# EasyEDA Pro project Development Board F.epro, board PCB1
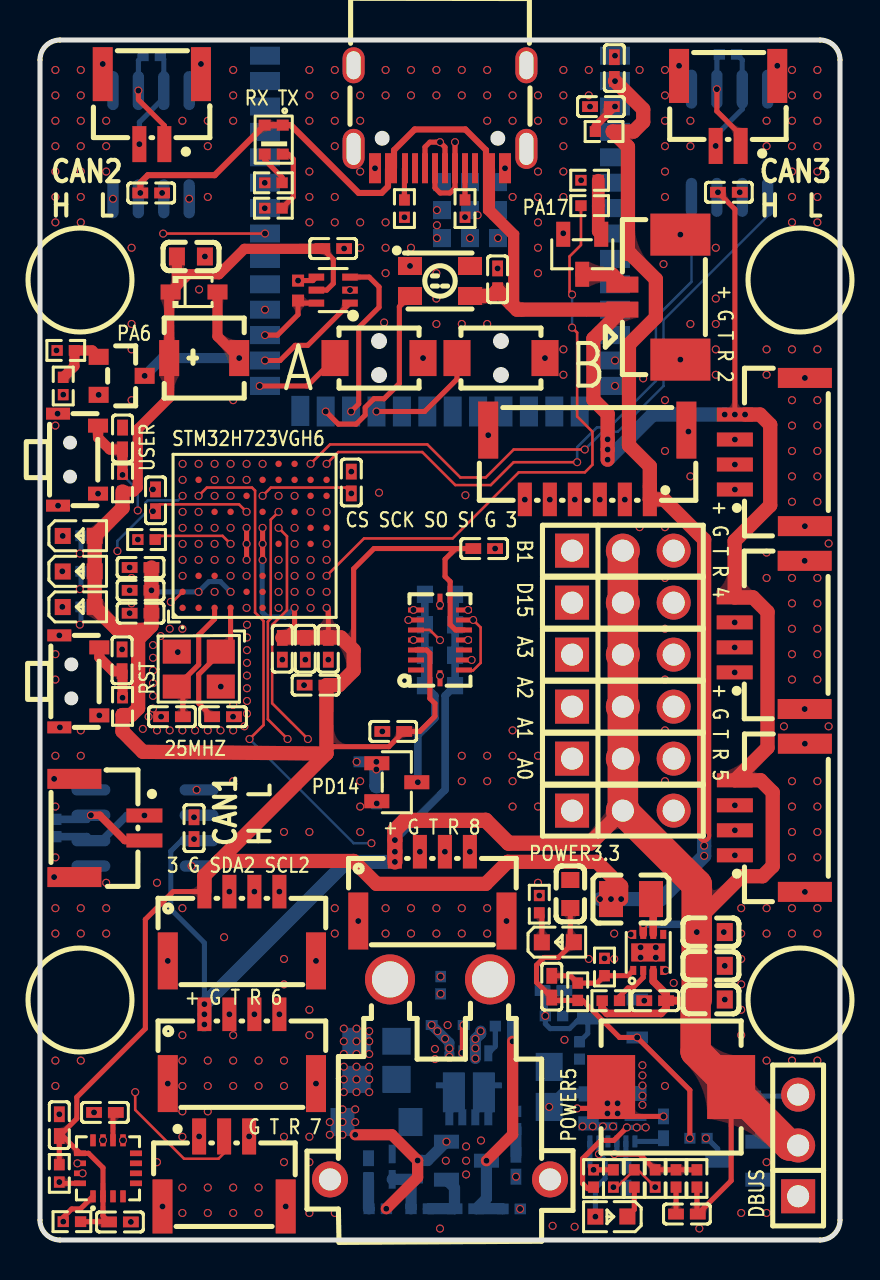
[diagram p1: board, top side]
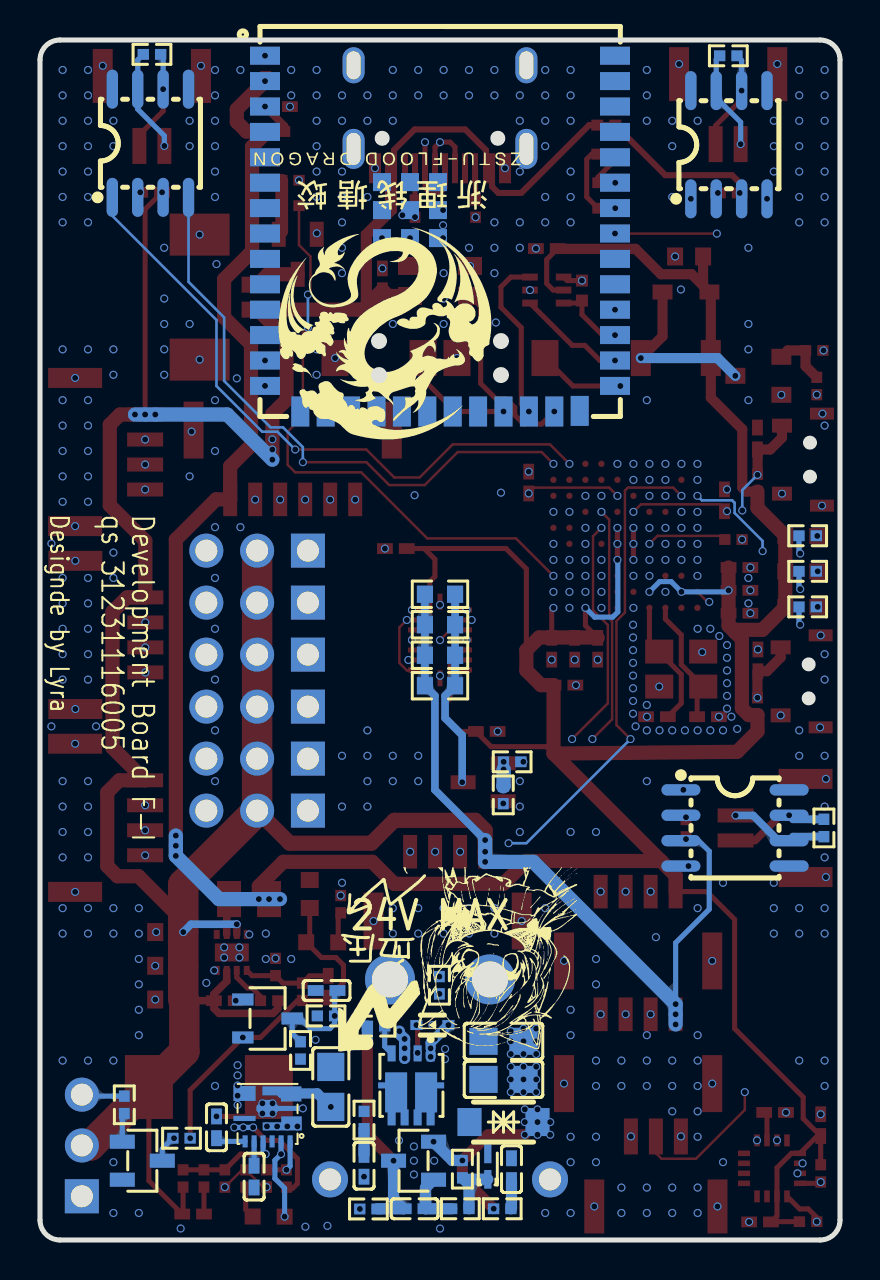
[diagram p2: board, bottom side, seen from below]

Outline 40 x 60 mm; copper layers: Top Layer, Inner1, Inner2, Inner3, Inner4, Bottom Layer. Coordinates in mm from the lower left corner of the outline.
Outline path: 0,59 0,1 arc(0.29,0.29) 1,0 39,0 arc(39.71,0.29) 40,1 40,59 arc(39.71,59.71) 39,60 1,60 arc(0.29,59.71) 0,59
Stack: Top Layer 0.035mm 外层铜厚1oz / Dielectric1 0.0994mm 3313 RC57% 4.2mil / Inner1 0.0152mm 内层铜厚 / Dielectric2 0.55mm 0.55mm H/H不含铜 / Inner2 0.0152mm 内层铜厚 / Dielectric3 0.1088mm 2116 RC54% 4.9mil / Inner3 0.0152mm 内层铜厚 / Dielectric4 0.55mm 0.55mm H/H不含铜 / Inner4 0.0152mm 内层铜厚 / Dielectric5 0.0994mm 3313 RC57% 4.2mil / Bottom Layer 0.035mm 外层铜厚1oz

## Design rules (mm)
net ESP_DP: DP1
net ESP_DN: DP1
template: 自定义配置
spacing copperThickness1oz: track to track 0.102, other pairs 0.152 to 0.3
spacing copperThickness2oz: track to track 0.203, other pairs 0.152 to 0.3
spacing copperThicknessInner0.5oz (default): track to track 0.089, other pairs 0.089 to 0.3
track width copperThickness1oz: min 0.102, default 0.254, max 2.54
track width copperThickness2oz: min 0.203, default 0.254, max 2.54
track width copperThickness0.5oz (default): min 0.089, default 0.254, max 2.54
differential pair differentialPair (default): width min 0.127, default 0.254, max 2.54; gap min 0.152, default 0.152
via viaSize (default): diameter min 0.3, default 0.4, max 10; hole min 0.2, default 0.3, max 6.3
net +24V uses copperRegion1
net +5V uses copperRegion1
net $1N3813 uses copperRegion1
net +3.3V uses copperRegion1
net ADC_BAT uses copperRegion1
net +24V_BAT uses copperRegion1
net GND_BAT uses copperRegion1

## Placement (name value [footprint] x y rotation side)
BUZZER3  4000Hz  [BUZ-SMD_L4.0-W4.0-P3.50-L]  8.21 44.1 0 top
C7  100nF  [C0402]  31.18 5.63 270 bottom
C8  220pF  [C0402]  32.34 1.3 0 top
C12  2.2uF  [C0402]  29.3 3.17 90 bottom
C13  10uF  [C0402]  30.76 11.97 0 top
C14  10pF  [C0402]  25.59 12.67 270 top
C15  22uF  [C0603]  33.54 13.71 180 top
C16  22uF  [C0603]  33.54 15.4 180 top
C17  22uF  [C0603]  33.54 12.02 180 top
C18  22uF  [C0603]  26.51 17.3 270 top
C36  2.2uF  [C0402]  5.78 36.98 270 top
C37  2.2uF  [C0402]  15.56 37.87 90 top
C48  12pF  [C0402]  9.15 26.17 0 top
C49  12pF  [C0402]  6.6 26.17 0 top
C75  10uF  [C0603]  7.55 49.18 180 top
C85  4.7uF  [C0402]  3.25 6.38 0 top
C96  1uF  [C0402]  28.05 56.67 0 top
C104  1uF  [C0402]  4.1 28.98 270 top
C105  1uF  [C0402]  4.13 40.08 270 top
C106  100nF  [C0402]  13.27 29.56 90 top
C107  100nF  [C0402]  14.42 29.56 90 top
C108  100nF  [C0402]  13.78 27.74 0 top
C109  100nF  [C0402]  5.03 32.48 0 top
C110  100nF  [C0402]  5.03 33.63 0 top
C111  100nF  [C0402]  5.03 31.34 0 top
C112  100nF  [C0402]  12.12 29.56 90 top
C113  100nF  [C0402]  7.7 20.59 90 top
C114  100nF  [C0402]  5.56 52.35 0 top
C115  100nF  [C0402]  34.44 52.39 0 top
C117  100nF  [C0402]  22.88 48.03 270 top
C118  100nF  [C0402]  28.72 58.6 90 top
C119  100nF  [C0402]  14.66 49.57 180 top
C120  100nF  [C0402]  0.97 5.74 270 top
C121  100nF  [C0402]  4 0.9 180 top
C122  100nF  [C0402]  17.66 25.43 0 top
C123  100nF  [C0402]  22.21 34.57 180 top
C124  100nF  [C0402]  25.67 12.47 180 bottom
C125  10uF  [C0805]  16.82 9.93 180 bottom
C126  10uF  [C0805]  16.82 8.03 180 bottom
C127  10uF  [C0805]  25.46 7.65 270 bottom
C128  10nF  [C0402]  16.43 3.54 270 bottom
C129  100nF  [C0402]  21.27 1.56 180 bottom
C130  10nF  [C0402]  23.8 3.71 90 bottom
CN5  A1251WV-S-2P  [CONN-SMD_2P-P1.25_A1251WV-S-2P]  30.57 47.14 90 top
CN11  XT30PW-M  [CONN-TH_XT30PW-M]  20 8.03 0 top
CN15  GH125-S04DCA-00  [CONN-SMD_4P-P1.27_GH125-S04DCA-00]  36.49 39.4 90 top
CN16  GH125-S04DCA-00  [CONN-SMD_4P-P1.27_GH125-S04DCA-00]  36.48 30.25 90 top
CN17  GH125-S04DCA-00  [CONN-SMD_4P-P1.27_GH125-S04DCA-00]  36.49 21.11 90 top
D8  1N4148WS  [SOD-323_L1.8-W1.3-LS2.5-RD]  7.7 47.4 0 top
D9  BAV99,215  [SOT-23-3_L2.9-W1.6-P1.90-LS2.8-BR]  28.62 11.08 0 bottom
D10  BZX584C9V1  [ESC_L1.2-W0.8-LS1.6-RD]  20.38 10.75 180 bottom
D11  BZX584C30V  [SOD-523_L1.2-W0.8-LS1.6-RD]  17.61 3.67 90 bottom
H4  PZ254V-11-03P  [HDR-TH_3P-P2.54-V-M]  37.91 4.73 90 top
H5  PZ254V-11-03P  [HDR-TH_3P-P2.54-V-M]  29.14 21.47 0 top
H6  PZ254V-11-03P  [HDR-TH_3P-P2.54-V-M]  29.14 24.07 0 top
H7  PZ254V-11-03P  [HDR-TH_3P-P2.54-V-M]  29.14 26.67 0 top
H8  PZ254V-11-03P  [HDR-TH_3P-P2.54-V-M]  29.14 29.27 0 top
H9  PZ254V-11-03P  [HDR-TH_3P-P2.54-V-M]  29.14 34.47 0 top
H10  PZ254V-11-03P  [HDR-TH_3P-P2.54-V-M]  29.14 31.87 0 top
KEY1  1TS003B-2500-3500A-CT  [KEY-SMD_1TS003B-2500-3500A-CT]  1.9 39.02 270 top
KEY2  1TS003B-2500-3500A-CT  [KEY-SMD_1TS003B-2500-3500A-CT]  1.97 27.93 270 top
L1  1.5uH  [IND-SMD_L7.0-W6.6]  31.56 7.65 180 top
L2  1.5uH  [L0806]  29.55 17.05 180 top
LED1  NCD0603R1  [LED0603-RD_RED]  28.57 1.17 180 top
LED2  NCD0603R1  [LED0603-RD_RED]  25.89 14.89 0 top
LED3  NCD0603G1  [LED0603-RD]  1.94 35.21 0 top
LED4  NCD0603B1  [LED0603-RD]  1.94 33.43 0 top
LED5  NCD0603Y1  [LED0603-RD]  1.94 31.65 0 top
LED6  XL-3528RGBW-WS2812B  [LED-SMD_4P-L3.5-W2.8-BR-1]  20 47.95 180 top
LED7  19-223/S2BHC-A01/2T  [LED-ARRAY-SMD_4P-L1.6-W1.5-BR_19-223]  11.69 55.02 90 top
Q4  YJL3400A  [SOT-23-3_L2.9-W1.3-P1.90-LS2.4-BR]  17.84 22.89 180 top
Q5  YJL3400A  [SOT-23-3_L2.9-W1.3-P1.90-LS2.4-BR]  27.11 49.29 90 top
Q6  PMBT3904,215  [SOT-23_L2.9-W1.3-P1.90-LS2.4-BR]  4.08 43.21 180 top
Q7  PMBT3906,215  [SOT-23-3_L2.9-W1.3-P1.90-LS2.4-BR]  21.32 3.97 180 bottom
R8  1kΩ  [R0402#2]  31.8 3.08 270 top
R9  100kΩ  [R0402#2]  32.85 3.08 270 top
R10  13.7kΩ  [R0402#2]  30.76 3.08 90 top
R11  100kΩ  [R0402#2]  27.68 3.08 270 top
R12  10kΩ  [R0402#2]  28.67 3.08 90 top
R13  100kΩ  [R0402#2]  28.54 11.97 0 top
R15  22.1kΩ  [R0402#2]  28.22 13.65 270 top
R16  100kΩ  [R0402#2]  26.88 12.41 90 top
R18  10kΩ  [R0402#2]  24.96 16.79 270 top
R79  120Ω  [R0402#2]  0.8 20.6 90 bottom
R80  120Ω  [R0402#2]  5.58 59.21 0 bottom
R81  120Ω  [R0402#2]  34.4 59.28 0 bottom
R118  10kΩ  [R0402#2]  5.33 35.02 0 top
R119  10kΩ  [R0402#2]  4.13 26.68 270 top
R120  10kΩ  [R0402#2]  4.13 37.86 270 top
R121  4.7kΩ  [R0402#2]  0.97 3.33 90 top
R135  NC  [R0402]  12.9 47.47 90 top
R137  5.1kΩ  [R0402#2]  21.25 51.57 90 top
R138  5.1kΩ  [R0402#2]  18.22 51.57 270 top
R141  10kΩ  [R0402#2]  16.84 22.25 90 bottom
R142  10kΩ  [R0402#2]  27.48 52.99 0 top
R143  10kΩ  [R0402#2]  1.16 42.7 90 top
R144  10kΩ  [R0402#2]  28.2 55.42 0 top
R145  4.7kΩ  [R0402#2]  35.78 6.76 90 bottom
R146  4.7kΩ  [R0402#2]  32.92 5.09 180 bottom
R147  510Ω  [R0402#2]  1.29 44.48 0 top
R148  510Ω  [R0402#2]  27.48 51.72 0 top
R177  100Ω  [R0603]  20 27.71 0 bottom
R178  100Ω  [R0603]  20 29.24 0 bottom
R179  100Ω  [R0603]  20 30.76 0 bottom
R180  100Ω  [R0603]  20 32.29 0 bottom
R181  120Ω  [R0402#2]  16.39 23.91 180 bottom
R182  4.7kΩ  [R0402#2]  1.6 0.92 0 top
R183  4.7kΩ  [R0402#2]  1.62 35.21 180 bottom
R184  4.7kΩ  [R0402#2]  1.62 33.43 180 bottom
R185  4.7kΩ  [R0402#2]  1.62 31.66 180 bottom
R186  4.7kΩ  [R0402#2]  11.67 52.86 180 top
R187  4.7kΩ  [R0402#2]  11.67 51.59 180 top
R188  200kΩ  [R0402#2]  26.97 9.48 270 bottom
R189  22kΩ  [R0402#2]  25.7 11.2 180 bottom
R190  33Ω  [R0402#2]  16.89 1.56 0 bottom
R191  100kΩ  [R0402#2]  20.03 12.74 90 bottom
R192  100kΩ  [R0402#2]  18.88 3.54 90 bottom
R193  1kΩ  [R0402#2]  18.98 1.56 0 bottom
R194  10kΩ  [R0402#2]  23.58 1.55 180 bottom
R195  1kΩ  [R0402#2]  23.2 10.7 180 bottom
R196  33Ω  [R0402#2]  23.8 6 90 bottom
R197  1kΩ  [R0402#2]  29.71 3.08 270 top
SW7  TS-1185-C-A-A-A  [SW-SMD_L4.0-W3.0-LS5.0-EH]  16.95 44.1 180 top
SW8  TS-1185-C-A-A-A  [SW-SMD_L4.0-W3.0-LS5.0-EH]  23.05 44.1 180 top
U1  SY8368AQQC  [QFN-12_L3.0-W3.0-P0.45-TL-EP]  28.64 6.13 0 bottom
U2  SY8883DFC  [WDFN-8_L2.0-W2.0-P0.50-BL-EP]  30.41 14.38 0 top
U6  STM32H723VGH6  [TFBGA-100_L8.0-W8.0-R10-C10-P0.80-BL]  10.73 35.21 0 top
U7  TJA1051T/CM,118  [SOIC-8_L5.0-W4.0-P1.27-LS6.1-BL]  34.48 54.84 180 bottom
U8  TJA1051T/CM,118  [SOIC-8_L5.0-W4.0-P1.27-LS6.1-BL]  5.55 54.77 180 bottom
U9  TJA1051T/CM,118  [SOIC-8_L5.0-W4.0-P1.27-LS6.1-BL]  5.25 20.6 270 bottom
U10  BMI088  [LGA-16_L4.5-W3.0-P0.50-BL]  20 30 0 top
U11  IST8310  [LGA-16_L3.0-W3.0-P0.5-BL]  3.4 3.58 0 top
U19  PMBT3904  [SOT-23-3_L2.9-W1.3-P1.90-LS2.4-BR]  34.88 3.97 0 bottom
U25  SGM3157  [SC-70-6_L2.2-W1.3-P0.65-LS2.1-BL]  14.66 47.5 90 top
U27  20009-UCAF001-X  [TYPE-C-SMD_20009-UCAF001-X]  20 56.16 180 top
U29  ESP32-S3-WROOM-1U-N8  [WIRELM-SMD_ESP32-S3-WROOM-1U]  20 50.32 180 bottom
U30  AP2716QD  [PDFN-8_L3.2-W3.1-P0.65-LS3.4-BL-EP2]  21.44 7.73 0 bottom
U31  SMF28CA  [SOD-123FL_L2.8-W1.8-LS3.7-BI]  16.82 5.9 180 bottom
X10  GH125-S02DCA-00  [CONN-SMD_2P-P1.25_JUSHUO_GH125-S02DCA-00]  34.41 56.45 180 top
X11  GH125-S02DCA-00  [CONN-SMD_2P-P1.25_JUSHUO_GH125-S02DCA-00]  5.59 56.54 180 top
X12  GH125-S02DCA-00  [CONN-SMD_2P-P1.25_JUSHUO_GH125-S02DCA-00]  3.47 20.6 270 top
X13  25MHz  [OSC-SMD_4P-L3.2-W2.5-BL]  7.94 28.55 180 top
X15  GH125-S03DCA-00  [CONN-SMD_3P-P1.25_JUSHUO_GH125-S03DCA-00]  9.21 3.43 0 top
X16  GH125-S04CCA-00  [CONN-SMD_4P-P1.25_JS_GH125-S04CCA-00]  10.09 15.69 0 top
X17  GH125-S06CCA-00  [CONN-SMD_6P-P1.25_JS_GH125-S06CCA-00]  27.37 38.76 180 top
X18  GH125-S04CCA-00  [CONN-SMD_4P-P1.25_JS_GH125-S04CCA-00]  19.62 17.68 0 top
X19  GH125-S04CCA-00  [CONN-SMD_4P-P1.25_JS_GH125-S04CCA-00]  10.09 9.55 0 top

## Footprints (pads in the part's own frame, mm; a bottom-side part is the same pattern mirrored in y, then rotated)
BUZ-SMD_L4.0-W4.0-P3.50-L
  rect 1x1.8 smd: 1(-1.75,0) 2(1.75,0)
C0402
  rect 0.79x0.54 smd: 1(-0.545,0) 2(0.545,0)
C0603
  rect 0.8x0.9 smd: 1(-0.7,0) 2(0.7,0)
C0805
  rect 1.41x1.35 smd: 1(-1,0) 2(1,0)
CONN-SMD_2P-P1.25_A1251WV-S-2P
  rect 0.8x1.6 smd: 1(-0.626,1.45) 2(0.624,1.45)
  rect 2.1x3 smd: 3(-3.125,-1.45) 4(3.125,-1.45)
CONN-SMD_2P-P1.25_JUSHUO_GH125-S02DCA-00
  rect 0.7x1.8 smd: 1(-0.625,1.75) 2(0.625,1.75)
  rect 1x2.7 smd: 3(2.455,-1.75) 4(-2.455,-1.75)
CONN-SMD_3P-P1.25_JUSHUO_GH125-S03DCA-00
  rect 0.7x1.8 smd: 1(-1.25,1.75) 2(0,1.75) 3(1.25,1.75)
  rect 1x2.7 smd: 4(3.08,-1.75) 5(-3.08,-1.75)
CONN-SMD_4P-P1.25_JS_GH125-S04CCA-00
  rect 0.7x1.68 smd: 1(-1.875,1.732) 2(-0.625,1.732) 3(0.625,1.732) 4(1.875,1.732)
  rect 1x2.85 smd: 5(3.705,-1.732) 6(-3.705,-1.732)
CONN-SMD_4P-P1.27_GH125-S04DCA-00
  rect 0.7x1.8 smd: 1(-1.875,1.75) 2(-0.625,1.75) 3(0.625,1.75) 4(1.875,1.75)
  rect 1x2.7 smd: 5(3.705,-1.75) 6(-3.705,-1.75)
CONN-SMD_6P-P1.25_JS_GH125-S06CCA-00
  rect 0.7x1.68 smd: 1(-3.125,1.732) 2(-1.875,1.732) 3(-0.625,1.732) 4(0.625,1.732) 5(1.875,1.732) 6(3.125,1.732)
  rect 1x2.85 smd: 7(4.955,-1.732) 8(-4.955,-1.732)
CONN-TH_XT30PW-M
  round 2.5 hole 1.8: 1(-2.5,5) 2(2.5,5)
  round 1.8 hole 1.1: 3(5.5,-5) 4(-5.5,-5)
ESC_L1.2-W0.8-LS1.6-RD
  rect 0.6x0.5 smd: 1(-0.8,0) 2(0.8,0)
HDR-TH_3P-P2.54-V-M
  rect 1.7x1.7 hole 1.1: 1(-2.54,0)
  round 1.7 hole 1.1: 2(0,0) 3(2.54,0)
IND-SMD_L7.0-W6.6
  rect 2.4x3.2 smd: 1(-3,0) 2(3,0)
KEY-SMD_1TS003B-2500-3500A-CT
  rect 0.6x1.2 smd: 0(-2.3,-1) 0(2.3,-1)
  rect 0.7x1 smd: 1(-1.7,1) 2(1.7,1)
L0806
  rect 1.2x1.8 smd: 1(-1,0) 2(1,0)
LED0603-RD
  rect 0.8x0.8 smd: 1(-0.799,-0.004) 2(0.799,0.004)
LED0603-RD_RED
  rect 0.8x0.8 smd: 1(-0.799,-0.004) 2(0.799,0.004)
LED-ARRAY-SMD_4P-L1.6-W1.5-BR_19-223
  rect 0.55x0.6 smd: 1(0.725,-0.45) 2(-0.725,-0.45) 3(0.725,0.45) 4(-0.725,0.45)
LED-SMD_4P-L3.5-W2.8-BR-1
  rect 1.2x0.9 smd: 1(1.5,-0.75) 2(1.5,0.75) 3(-1.5,0.75) 4(-1.5,-0.75)
LGA-16_L3.0-W3.0-P0.5-BL
  rect 0.28x0.6 smd: 1(-0.75,-1.4) 2(-0.25,-1.4) 3(0.25,-1.4) 4(0.75,-1.4) 9(0.75,1.4) 10(0.25,1.4) 11(-0.25,1.4) 12(-0.75,1.4)
  rect 0.6x0.28 smd: 5(1.4,-0.75) 6(1.4,-0.25) 7(1.4,0.25) 8(1.4,0.75) 13(-1.4,0.75) 14(-1.4,0.25) 15(-1.4,-0.25) 16(-1.4,-0.75)
LGA-16_L4.5-W3.0-P0.50-BL
  rect 0.8x0.25 smd: 1(-1.2,-1.498) 2(-1.2,-0.998) 3(-1.2,-0.498) 4(-1.2,0.002) 5(-1.2,0.502) 6(-1.2,1.002) 7(-1.2,1.502) 9(1.2,1.502) 10(1.2,1.002) 11(1.2,0.502) 12(1.2,0.002) 13(1.2,-0.498) 14(1.2,-0.998) 15(1.2,-1.498)
  rect 0.25x0.8 smd: 8(0,1.915) 16(0,-1.915)
OSC-SMD_4P-L3.2-W2.5-BL
  rect 1.4x1.2 smd: 1(-1.1,-0.875) 2(1.1,-0.875) 3(1.1,0.875) 4(-1.1,0.875)
PDFN-8_L3.2-W3.1-P0.65-LS3.4-BL-EP2
  rect 0.4x0.8 smd: 1(-0.975,-1.6) 2(-0.325,-1.6) 3(0.325,-1.6) 4(0.975,-1.6) 5(0.975,1.6) 6(0.325,1.6) 7(-0.325,1.6) 8(-0.975,1.6)
  custom 1.45x2 smd: 9(-0.925,0.35) 10(0.925,0.35)
QFN-12_L3.0-W3.0-P0.45-TL-EP
  custom 1.95x0.702 smd: 1(-0.746,0.299)
  custom 1.099x0.851 smd: 2(-0.01,-0.45)
  custom 1.95x0.752 smd: 3(-0.732,-1.2)
  rect 1.1x0.75 smd: 4(1.141,-1.198)
  rect 1.1x0.26 smd: 5(1.141,0.051) 6(1.141,0.502)
  rect 0.25x0.6 smd: 7(1.109,1.2) 8(0.659,1.2) 9(0.209,1.2) 10(-0.24,1.2) 11(-0.691,1.2) 12(-1.141,1.2)
R0402
  rect 0.6x0.6 smd: 1(-0.5,0) 2(0.5,0)
R0402#2
  rect 0.566x0.54 smd: 1(-0.433,0) 2(0.433,0)
R0603
  rect 0.806x0.864 smd: 1(-0.753,0) 2(0.753,0)
SC-70-6_L2.2-W1.3-P0.65-LS2.1-BL
  rect 0.35x0.78 smd: 1(-0.65,-0.84) 2(0,-0.84) 3(0.65,-0.84) 4(0.65,0.84) 5(0,0.84) 6(-0.65,0.84)
SOD-123FL_L2.8-W1.8-LS3.7-BI
  rect 1.2x1.4 smd: 1(-1.7,0) 2(1.7,0)
SOD-323_L1.8-W1.3-LS2.5-RD
  rect 1x0.75 smd: 1(-1.173,0) 2(1.173,0)
SOD-523_L1.2-W0.8-LS1.6-RD
  rect 0.93x0.36 smd: 1(-0.635,0) 2(0.635,0)
SOIC-8_L5.0-W4.0-P1.27-LS6.1-BL
  oval 0.569x1.95 smd: 1(-1.905,-2.705) 2(-0.635,-2.705) 3(0.635,-2.705) 4(1.905,-2.705) 5(1.905,2.705) 6(0.635,2.705) 7(-0.635,2.705) 8(-1.905,2.705)
SOT-23-3_L2.9-W1.3-P1.90-LS2.4-BR
  rect 1.25x0.7 smd: 1(1,-0.95) 2(1,0.95) 3(-1,0)
SOT-23-3_L2.9-W1.6-P1.90-LS2.8-BR
  rect 1.07x0.6 smd: 1(1.235,-0.95) 2(1.235,0.95) 3(-1.235,0)
SOT-23_L2.9-W1.3-P1.90-LS2.4-BR
  rect 1x0.8 smd: 1(1.15,-0.95) 2(1.15,0.95) 3(-1.15,0)
SW-SMD_L4.0-W3.0-LS5.0-EH
  rect 1.35x1.8 smd: 1(-2.2,0) 2(2.2,0)
TFBGA-100_L8.0-W8.0-R10-C10-P0.80-BL
  round 0.32 smd: A1(-3.6,-3.6) A2(-3.6,-2.8) A3(-3.6,-2) A4(-3.6,-1.2) A5(-3.6,-0.4) A6(-3.6,0.4) A7(-3.6,1.2) A8(-3.6,2) A9(-3.6,2.8) A10(-3.6,3.6) B1(-2.8,-3.6) B2(-2.8,-2.8) B3(-2.8,-2) B4(-2.8,-1.2) B5(-2.8,-0.4) B6(-2.8,0.4) B7(-2.8,1.2) B8(-2.8,2) B9(-2.8,2.8) B10(-2.8,3.6) C1(-2,-3.6) C2(-2,-2.8) C3(-2,-2) C4(-2,-1.2) C5(-2,-0.4) C6(-2,0.4) C7(-2,1.2) C8(-2,2) C9(-2,2.8) C10(-2,3.6) D1(-1.2,-3.6) D2(-1.2,-2.8) D3(-1.2,-2) D4(-1.2,-1.2) D5(-1.2,-0.4) D6(-1.2,0.4) D7(-1.2,1.2) D8(-1.2,2) D9(-1.2,2.8) D10(-1.2,3.6) E1(-0.4,-3.6) E2(-0.4,-2.8) E3(-0.4,-2) E4(-0.4,-1.2) E5(-0.4,-0.4) E6(-0.4,0.4) E7(-0.4,1.2) E8(-0.4,2) E9(-0.4,2.8) E10(-0.4,3.6) F1(0.4,-3.6) F2(0.4,-2.8) F3(0.4,-2) F4(0.4,-1.2) F5(0.4,-0.4) F6(0.4,0.4) F7(0.4,1.2) F8(0.4,2) F9(0.4,2.8) F10(0.4,3.6) G1(1.2,-3.6) G2(1.2,-2.8) G3(1.2,-2) G4(1.2,-1.2) G5(1.2,-0.4) G6(1.2,0.4) G7(1.2,1.2) G8(1.2,2) G9(1.2,2.8) G10(1.2,3.6) H1(2,-3.6) H2(2,-2.8) H3(2,-2) H4(2,-1.2) H5(2,-0.4) H6(2,0.4) H7(2,1.2) H8(2,2) H9(2,2.8) H10(2,3.6) J1(2.8,-3.6) J2(2.8,-2.8) J3(2.8,-2) J4(2.8,-1.2) J5(2.8,-0.4) J6(2.8,0.4) J7(2.8,1.2) J8(2.8,2) J9(2.8,2.8) J10(2.8,3.6) K1(3.6,-3.6) K2(3.6,-2.8) K3(3.6,-2) K4(3.6,-1.2) K5(3.6,-0.4) K6(3.6,0.4) K7(3.6,1.2) K8(3.6,2) K9(3.6,2.8) K10(3.6,3.6)
TYPE-C-SMD_20009-UCAF001-X
  oval 1.1x2 hole 0.7x1.6: 1(-4.32,1.606) 2(4.32,1.606)
  oval 1.1x1.8 hole 0.7x1.4: 3(4.32,-2.574) 4(-4.32,-2.574)
  rect 0.3x1.5 smd: A1(-3.4,2.573) A4(-2.6,2.573) A5(-1.25,2.573) A6(-0.25,2.573) A7(0.25,2.573) A8(1.25,2.574) A9(2.6,2.574) A12(3.4,2.573) B1(3.1,2.573) B4(2.3,2.574) B5(1.75,2.573) B6(0.75,2.573) B7(-0.75,2.573) B8(-1.75,2.574) B9(-2.3,2.573) B12(-3.1,2.573)
WDFN-8_L2.0-W2.0-P0.50-BL-EP
  rect 0.3x0.45 smd: 1(-0.75,-0.9) 2(-0.25,-0.9) 3(0.25,-0.9) 4(0.75,-0.9) 5(0.75,0.9) 6(0.25,0.9) 7(-0.25,0.9) 8(-0.75,0.9)
  rect 1.7x0.9 smd: 9(-0.002,-0.001)
WIRELM-SMD_ESP32-S3-WROOM-1U
  rect 1.5x0.9 smd: 1(-8.75,8.895) 2(-8.75,7.625) 3(-8.75,6.355) 4(-8.75,5.085) 5(-8.75,3.815) 6(-8.75,2.545) 7(-8.75,1.275) 8(-8.75,0.005) 9(-8.75,-1.265) 10(-8.75,-2.535) 11(-8.75,-3.805) 12(-8.75,-5.075) 13(-8.75,-6.345) 14(-8.75,-7.615) 27(8.75,-7.615) 28(8.75,-6.345) 29(8.75,-5.075) 30(8.75,-3.805) 31(8.75,-2.535) 32(8.75,-1.265) 33(8.75,0.005) 34(8.75,1.275) 35(8.75,2.545) 36(8.75,3.815) 37(8.75,5.085) 38(8.75,6.355) 39(8.75,7.625) 40(8.75,8.895)
  rect 0.9x1.5 smd: 15(-6.985,-8.895) 16(-5.715,-8.895) 17(-4.445,-8.895) 18(-3.175,-8.895) 19(-1.905,-8.895) 20(-0.635,-8.895) 21(0.635,-8.895) 22(1.905,-8.895) 23(3.175,-8.895) 24(4.445,-8.895) 25(5.715,-8.895) 26(6.985,-8.865)
  rect 0.9x0.9 smd: 41(-2.9,-0.225) 41(-2.9,1.175) 41(-2.9,2.575) 41(-1.5,-0.225) 41(-1.5,1.175) 41(-1.5,2.575) 41(-0.1,-0.225) 41(-0.1,1.175) 41(-0.1,2.575)

## Nets
As in the schematic, except:
CS1_ACCEL: U6.G3 U10.14
CS1_GYRO: U6.J4 U10.5
INT1_ACCEL: U6.G4 U10.16
INT1_GYRO: U6.H4 U10.12

Pads without a net: CN11 3 4; LED6 4; U1 10; U2 5; U6 B3 B9 C3 C7 D7 E2 E8 F1 F2 F3 F7 F9 G5 G9 G10 H7 H9 H10 J5 J6 J8 J9 K6 K8 K9; U7 5; U8 5; U9 5; U10 1 2 13; U11 3 4 5 6 7 8 12; U27 A8 B8; U29 4 5 6 7 8 9 10 11 12 15 16 17 18 19 20 21 22 26 31 32 36 37 38 39

## Via types
v1: diameter 0.4, hole 0.3, Top Layer to Bottom Layer, 404 vias
v2: diameter 0.402, hole 0.299, Top Layer to Bottom Layer, 272 vias

## Routing (per net, layer and track width the routed paths; a pad name or vN(x,y) marks a point on that pad's centre or on a via; arc(x,y) is an arc through that point)
+3.3V: length 226.4
  Top Layer w0.254: C107.2 14.42,31.52 v1(14.33,31.61) ; R182.2 3.44,0.92 ; 3.44,0.92 C121.2 ; 3.44,0.92 3.15,1.21 U11.2 3.15,3.61 2.43,4.33 U11.13 1.14,5.2 C120.2 ; C18.2 26.51,15.07 LED2.2 25.93,14.12 25.21,14.12 24.83,13.74 24.83,12.88 C14.2 25.73,11.98 R16.1 27.13,11.98 28.98,10.13 v1(29.86,10.13) 32.49,7.49 v1(32.49,5.09) ; v1(11.13,34.01) v1(11.13,34.81) v1(11.13,35.61) ; C123.2 20.79,34.57 ; 20.79,34.57 16.7,34.57 15.68,33.56 15.68,29.49 ; 20.79,34.57 20.25,34.04 20.25,33.17 20.51,32.92 20.51,30.77 20.77,30.5 U10.11 ; 14.32,24.32 14.67,24.67 17.44,24.67 C122.2 18.99,25.43 19.75,26.19 19.75,26.83 19.49,27.08 19.49,29.34 19.33,29.5 U10.3 ; C120.2 R121.2 ; C120.2 1.84,6.07 1.84,7.14 5.27,10.57 5.27,16.03 6.66,17.42 X16.1 ; C119.2 14.67,49.02 14.67,47.83 14.34,47.5 U25.5 ; 12.14,30.13 12.73,30.72 v1(12.73,31.61)
  Top Layer w0.508: 6.85,47.72 7.42,48.29 8.95,48.29 10.22,49.56 14.1,49.56 C119.2 ; 6.85,47.72 D8.1 6.46,47.33 BUZZER3.1 6.46,42.11 4.89,40.54 4.89,37.62 4.69,37.42 4.13,37.42 ; 6.85,47.72 C75.2
  Top Layer w0.711: C112.2 12.14,30.13 15.05,30.13 15.68,29.49 15.68,28.48 14.95,27.74 C108.2 14.32,24.32 ; 5.27,30.41 4.91,30.05 4.91,26.59 4.56,26.25 4.13,26.25 4.12,25.43 5.14,24.41 14.32,24.32 ; 5.27,30.41 5.57,30.71 C111.2 v1(5.57,32.48) C110.2 ; 5.27,30.41 5.17,30.51 3.88,30.51 LED5.2 LED4.2 LED3.2 4.13,36.6 4.13,37.42 ; 8.95,18.95 15.68,18.95 16.82,17.81 22.29,17.81 23.39,18.91 27.84,18.91 29.06,17.69 v1(29.06,17.05) ; 8.95,18.95 8.22,18.22 X16.1 ; 8.95,18.95 14.32,24.32 ; v1(28.75,57.94) 30.16,56.53 30.16,55.91 29.68,55.42 R144.2 29.4,54.66 29.4,49.3 29.53,49.3 30.79,48.03 30.79,46.13 29.45,44.78 29.45,39.73 30.49,38.69 X17.1 31.2,37.03 33.21,35.02 v1(33.21,20.22)
  Bottom Layer w0.254: v1(11.13,34.01) 11.11,33.99 11.11,31.4 11.36,31.14 12.26,31.14 v1(12.73,31.61) ; v1(5.57,32.48) 5.65,32.41 v1(7.93,32.41) 8.44,32.92 9.01,32.92 v1(9.53,32.41)
  Bottom Layer w0.711: v1(28,17.05) v1(28.55,17.05) v1(29.06,17.05) 31.05,17.05 v1(33.21,19.2) v1(33.21,19.71) v1(33.21,20.22)
+5V: length 212.3
  Top Layer w0.254: R9.2 32.85,1.34 C8.2 34.56,2.96 L1.1 ; v1(33.9,52.39) 34.74,51.54 v1(34.74,41.27)
  Top Layer w0.305: v1(5.01,52.35) 5.01,52.86 5.4,53.24 8.73,53.24 LED7.3 LED7.1 12.54,55.74 15.94,52.35 17.08,52.35 17.4,52.67 U27.A9 ; 22.6,53.59 22.6,51.53 23.81,50.32 23.81,46.8 24.09,46.52 ; U27.B4 17.7,54.49 18.74,55.53 21.27,55.53 22.3,54.5 22.3,51.45 23.56,50.19 23.56,46.81
  Top Layer w0.381: C13.2 31.3,11.59 31.05,11.33 28.35,11.33 28.11,11.57 R13.1 ; C13.2 32.78,11.97 C17.2 ; C13.2 31.3,12.3 30.66,12.94 U2.3 ; U2.7 v1(30.16,15.79)
  Top Layer w0.711: LED6.3 22.59,47.2 C117.2 23.56,46.81 23.85,46.52 29.12,46.52 27.67,45.07 27.67,42.01 28.38,41.3 v1(28.38,40.03) v1(28.38,39.53) v1(28.38,39.02) ; v1(35.25,41.27) 36,41.27 36.51,40.77 36.51,36.73 34.73,34.95 CN16.4 35.65,32.13 36.38,31.4 36.38,24.62 CN17.4 36.03,22.98 36.64,22.38 36.64,18.7 36.13,18.19 35.08,18.19 32.84,15.95
  Top Layer w0.762: H5.2 27.52,19.84 23.43,19.84 22.29,20.98 18.24,20.98 17.74,20.49 v1(17.74,20) v1(17.74,19.41) v1(17.74,18.91)
  Top Layer w1.524: C17.2 C15.2 v1(32.84,15.4) 32.84,17.77 H5.2 H6.2 H7.2 H8.2 H10.2 H9.2 ; 32.78,11.97 32.78,9.42 L1.1 37.48,4.73 H4.2
  Bottom Layer w0.254: v1(8.22,11.79) 8.22,14.86 6.54,16.54 6.54,19.44 7.15,20.05 v1(7.7,20.05)
  Bottom Layer w0.381: v1(17.74,20) 20.25,22.51 20.25,27.21 R177.2 R178.2 R179.2 R180.2 ; v1(30.16,15.79) 32.45,15.79 v1(32.84,15.4)
  Bottom Layer w0.711: v1(35.25,41.27) v1(34.74,41.27) v1(34.24,41.27) 30.64,41.27 v1(28.38,39.02) ; v1(17.74,20) v1(17.74,19.41) v1(17.74,18.91) 15.33,18.91 v1(8.22,11.79) v1(8.22,11.29) v1(8.22,10.78)
+24V: length 4.8
  Top Layer w0.254: R11.2 27.6,2.57 27.38,2.57 27.13,2.82 27.13,4.07 28.04,4.98 28.7,4.98 v1(29.34,5.63)
  vias: v1(29.84,5.63) v1(30.12,8.74) v1(30.12,8.23) v1(30.12,7.72) v1(30.12,7.22) v1(30.12,6.75) v1(30.28,5.63)
+24V_BAT: length 10
  Top Layer w0.559: v1(17.31,1.56) 18.88,3.13 v1(18.88,3.97) 17.59,5.26 v1(15.76,5.26)
  Bottom Layer w0.559: v1(21.77,9.08) v1(21.77,9.59) v1(21.77,10.05) 22.03,10.31 v1(22.03,10.44) ; v1(18.88,3.97) 19.38,3.97 v1(20.32,4.91)
  vias: v1(14.49,5.9) v1(14.49,5.26) v1(15.12,6.53) v1(15.12,5.9) v1(15.12,5.26) v1(15.19,10.57) v1(15.19,9.93) v1(15.19,9.3) v1(15.19,8.66) v1(15.19,8.03) v1(15.19,7.39) v1(15.82,10.57) v1(15.82,9.93) v1(15.82,9.3) v1(15.82,8.66) v1(15.82,8.03) v1(15.82,7.39) v1(15.76,6.53) v1(15.76,5.9) v1(16.46,10.44) v1(16.46,9.93) v1(16.46,9.3) v1(16.46,8.66) v1(16.46,8.03) v1(16.46,7.39) v1(20.03,13.17)
GND: length 9.1
  Top Layer w0.127: v1(30.76,2.64) 29.89,3.51 R197.1 28.85,2.64 v1(28.67,2.64)
  Top Layer w0.254: v1(10.33,35.61) v1(10.33,34.81) v1(10.33,34.01)
  Bottom Layer w0.254: v1(20.47,9.59) U30.1
  Bottom Layer w0.508: v1(20.47,9.59) 20.47,9.86 v1(19.58,10.75) ; v1(20.47,9.16) U30.1 ; 27.9,7.33 26.14,7.33 v1(25.46,6.65)
  vias: v1(0.71,23.06) v1(0.71,18.15) v1(0.88,41.32) v1(0.9,36.72) v1(0.97,30.23) v1(1,25.63) v1(0.97,6.29) v1(1.16,42.27) v1(2.7,6.38) v1(2.93,42.26) v1(2.9,37.32) v1(2.97,26.23) v1(3.14,58.8) v1(3.15,4.98) v1(4.1,29.53) v1(4.15,4.98) v1(4.48,33.63) v1(4.48,32.48) v1(4.48,31.34) v1(4.54,0.9) v1(4.89,35.02) v1(5.14,25.56) v1(5.43,26.17) v1(5.65,37.53) v1(5.65,29.75) v1(5.65,29.11) v1(5.65,28.48) v1(5.65,27.84) v1(5.65,27.21) v1(5.65,26.57) v1(6.03,30.2) v1(6.1,52.35) v1(6.05,26.17) v1(6.12,1.68) v1(6.39,13.95) v1(6.39,7.82) v1(6.48,30.56) v1(6.48,25.48) v1(6.89,29.39) v1(7.12,25.48) v1(7.7,21.14) v1(7.75,25.48) v1(8.05,58.8) v1(7.96,47.53) v1(7.96,5.18) v1(8.25,49.18) v1(8.39,25.48) v1(8.73,32.41) v1(9.04,27.67) v1(9.02,25.48) v1(9.21,15.14) v1(9.47,17.42) v1(9.47,11.29) v1(9.65,26.17) v1(10.22,25.68) v1(10.35,30.76) v1(10.35,30.13) v1(10.35,29.49) v1(10.35,28.86) v1(10.35,28.22) v1(10.35,27.59) v1(10.35,26.95) v1(10.35,26.32) v1(11.93,31.61) v1(12.12,29.02) v1(12.28,1.68) v1(13.2,27.74) v1(13.27,29.02) v1(13.53,31.61) v1(13.8,13.95) v1(13.8,7.82) v1(14.42,29.02) v1(15.21,49.57) v1(15.5,47.5) v1(15.56,38.42) v1(15.91,15.95) v1(16.75,53.59) v1(16.84,21.83) v1(16.95,37.37) v1(17.12,25.43) v1(17.21,45.88) v1(18.22,51.14) v1(18.42,31) v1(18.5,48.7) v1(18.67,31.5) v1(18.67,30) v1(18.99,19.41) v1(19.15,44.1) v1(19.75,9.55) v1(19.85,51.5) v1(19.85,50.74) v1(19.85,50.09) v1(19.75,9.04) v1(19.87,10.44) v1(20,0.57) v1(20.25,10.06) v1(20.29,3.97) v1(20.38,10.75) v1(21.25,51.15) v1(21.27,37.24) v1(21.3,4.68) v1(21.3,3.97) v1(21.3,3.28) v1(21.5,50.09) v1(21.88,51.24) v1(22.05,4.98) v1(22.41,40.24) v1(22.75,34.57) v1(22.9,50.09) v1(22.88,48.58) v1(23.25,53.59) v1(23.32,15.95) v1(23.8,3.17) v1(24,1.55) v1(24.96,17.22) v1(25.25,44.1) v1(25.63,0.71) v1(26.16,50.34) v1(26.22,10.01) v1(26.73,0.66) v1(27.06,52.99) v1(27.13,5.68) v1(27.5,56.67) v1(27.64,5.68) v1(28.14,5.68) v1(28.22,14.08) v1(28.65,5.68) v1(28.75,59.22) v1(29.24,37.02) v1(29.53,15.28) v1(30.03,14.63) v1(30.03,14.12) v1(30.16,43.08) v1(30.21,11.97) v1(30.79,14.63) v1(30.79,14.12) v1(31.18,48.8) v1(31.29,13.48) v1(31.68,12.86) v1(31.95,58.71) v1(32.02,50.27) v1(32.02,44.02) v1(32.42,40.42) v1(32.97,0.57) v1(34.19,15.4) v1(34.24,13.71) v1(34.24,12.02) v1(34.74,40.02) v1(34.73,30.88) v1(34.74,21.73) v1(34.99,52.39) v1(36.86,58.71) v1(37.2,25.68) v1(38.24,43.1) v1(38.24,35.69) v1(38.23,33.96) v1(38.23,26.55) v1(38.24,24.81) v1(38.24,17.41) v1(39.43,34.83) v1(39.43,25.68) v2(0.77,58.5) v2(0.77,57.23) v2(0.77,55.96) v2(0.77,54.69) v2(0.77,53.42) v2(0.77,52.15) v2(0.77,50.88) v2(0.77,40.72) v2(0.77,29.29) v2(0.77,28.02) v2(0.77,24.21) v2(0.77,21.67) v2(0.77,19.13) v2(0.77,16.59) v2(0.77,15.32) v2(0.77,8.97) v2(0.77,7.7) v2(2.04,58.5) v2(2.04,57.23) v2(2.04,55.96) v2(2.04,54.69) v2(2.04,53.42) v2(2.04,52.15) v2(2.04,50.88) v2(2.04,25.48) v2(2.04,24.21) v2(2.04,16.59) v2(2.04,15.32) v2(2.04,8.97) v2(3.31,55.96) v2(3.31,54.69) v2(3.31,53.42) v2(3.31,17.86) v2(3.31,16.59) v2(3.31,15.32) v2(4.58,49.61) v2(4.58,45.8) v2(4.58,44.53) v2(4.58,41.99) v2(4.58,33.1) v2(4.58,31.83) v2(5.85,25.48) v2(5.85,17.86) v2(5.85,3.89) v2(7.12,55.96) v2(7.12,30.56) v2(7.12,16.59) v2(7.12,10.24) v2(7.12,8.97) v2(7.12,7.7) v2(7.12,6.43) v2(7.12,5.16) v2(7.12,2.62) v2(7.12,1.35) v2(8.39,55.96) v2(8.39,54.69) v2(8.39,52.15) v2(8.39,8.97) v2(8.39,7.7) v2(8.39,6.43) v2(8.39,2.62) v2(8.39,1.35) v2(9.66,58.5) v2(9.66,57.23) v2(9.66,55.96) v2(9.66,41.99) v2(9.66,26.75) v2(9.66,25.48) v2(9.66,22.94) v2(9.66,10.24) v2(9.66,8.97) v2(9.66,7.7) v2(9.66,2.62) v2(9.66,1.35) v2(10.93,8.97) v2(10.93,7.7) v2(10.93,2.62) v2(10.93,1.35) v2(12.2,20.4) v2(12.2,14.05) v2(12.2,12.78) v2(12.2,8.97) v2(12.2,7.7) v2(12.2,5.16) v2(12.2,3.89) v2(13.47,58.5) v2(13.47,57.23) v2(13.47,55.96) v2(13.47,53.42) v2(13.47,52.15) v2(13.47,50.88) v2(13.47,20.4) v2(13.47,11.51) v2(13.47,10.24) v2(13.47,5.16) v2(13.47,3.89) v2(13.47,1.35) v2(14.74,58.5) v2(14.74,57.23) v2(14.74,55.96) v2(14.74,54.69) v2(14.74,52.15) v2(14.74,50.88) v2(14.74,16.59) v2(14.74,15.32) v2(14.74,1.35) v2(16.01,57.23) v2(16.01,55.96) v2(16.01,53.42) v2(16.01,50.88) v2(16.01,49.61) v2(16.01,22.94) v2(16.01,21.67) v2(16.01,20.4) v2(17.28,58.5) v2(17.28,57.23) v2(17.28,50.88) v2(17.28,49.61) v2(17.28,48.34) v2(17.28,16.59) v2(17.28,15.32) v2(18.55,58.5) v2(18.55,57.23) v2(18.55,49.61) v2(18.55,16.59) v2(18.55,15.32) v2(19.82,58.5) v2(19.82,57.23) v2(19.82,48.34) v2(19.82,47.07) v2(19.82,45.8) v2(19.82,16.59) v2(19.82,15.32) v2(21.09,58.5) v2(21.09,57.23) v2(21.09,45.8) v2(21.09,24.21) v2(21.09,22.94) v2(21.09,16.59) v2(21.09,15.32) v2(22.36,58.5) v2(22.36,57.23) v2(22.36,55.96) v2(22.36,45.8) v2(22.36,24.21) v2(22.36,22.94) v2(22.36,16.59) v2(22.36,15.32) v2(23.63,57.23) v2(23.63,55.96) v2(23.63,52.15) v2(23.63,25.48) v2(23.63,24.21) v2(23.63,22.94) v2(23.63,21.67) v2(24.9,57.23) v2(24.9,55.96) v2(24.9,53.42) v2(24.9,52.15) v2(24.9,50.88) v2(24.9,49.61) v2(24.9,48.34) v2(24.9,24.21) v2(24.9,21.67) v2(24.9,17.86) v2(26.17,58.5) v2(26.17,57.23) v2(26.17,55.96) v2(26.17,54.69) v2(26.17,53.42) v2(26.17,52.15) v2(26.17,44.53) v2(26.17,43.26) v2(27.44,58.5) v2(27.44,57.23) v2(27.44,14.05) v2(28.71,15.32) v2(28.71,14.05) v2(29.98,58.5) v2(29.98,35.64) v2(31.25,58.5) v2(31.25,57.23) v2(31.25,55.96) v2(31.25,54.69) v2(31.25,53.42) v2(31.25,52.15) v2(31.25,41.99) v2(31.25,39.45) v2(31.25,35.64) v2(31.25,33.1) v2(31.25,30.56) v2(31.25,28.02) v2(31.25,25.48) v2(31.25,22.94) v2(31.25,7.7) v2(32.52,55.96) v2(32.52,54.69) v2(32.52,45.8) v2(32.52,38.18) v2(33.79,49.61) v2(33.79,47.07) v2(33.79,45.8) v2(33.79,44.53) v2(33.79,43.26) v2(35.06,16.59) v2(35.06,15.32) v2(35.06,14.05) v2(35.06,12.78) v2(35.06,11.51) v2(35.06,10.24) v2(35.06,1.35) v2(36.33,55.96) v2(36.33,54.69) v2(36.33,44.53) v2(36.33,43.26) v2(36.33,34.37) v2(36.33,33.1) v2(36.33,16.59) v2(36.33,15.32) v2(36.33,8.97) v2(36.33,3.89) v2(36.33,1.35) v2(37.6,58.5) v2(37.6,57.23) v2(37.6,55.96) v2(37.6,54.69) v2(37.6,53.42) v2(37.6,52.15) v2(37.6,50.88) v2(37.6,44.53) v2(37.6,41.99) v2(37.6,40.72) v2(37.6,39.45) v2(37.6,38.18) v2(37.6,36.91) v2(37.6,33.1) v2(37.6,31.83) v2(37.6,30.56) v2(37.6,29.29) v2(37.6,28.02) v2(37.6,22.94) v2(37.6,21.67) v2(37.6,20.4) v2(37.6,19.13) v2(37.6,16.59) v2(37.6,15.32) v2(37.6,8.97) v2(38.87,58.5) v2(38.87,57.23) v2(38.87,55.96) v2(38.87,54.69) v2(38.87,53.42) v2(38.87,52.15) v2(38.87,50.88) v2(38.87,44.53) v2(38.87,41.99) v2(38.87,40.72) v2(38.87,39.45) v2(38.87,38.18) v2(38.87,36.91) v2(38.87,33.1) v2(38.87,31.83) v2(38.87,30.56) v2(38.87,29.29) v2(38.87,28.02) v2(38.87,22.94) v2(38.87,21.67) v2(38.87,20.4) v2(38.87,19.13) v2(38.87,16.59) v2(38.87,15.32) v2(38.87,8.97)
ADC_BAT: length 36.6
  Inner3 w0.127: 25.21,11.2 24.83,11.59 24.83,13.49 20.38,17.94 16.7,17.94 15.45,19.18 15.45,33.03 14.92,33.56 13.08,33.56 v1(12.73,33.21)
  Bottom Layer w0.254: C124.2 25.27,12.33 v1(25.27,11.2) 25.27,10.81 25.51,10.57 26.48,10.57 26.99,11.08 D9.3 27.39,10.32 R188.1
BOOT0: length 4
  Top Layer w0.127: R118.2 5.94,35.21 9.13,35.21 v1(9.53,34.81)
BS: length 7.5
  Top Layer w0.254: v1(26.86,6.58) 27.49,6.58 L1.2 28.56,7.09 29.47,6.18 v1(31.18,6.18)
  Bottom Layer w0.254: v1(26.86,6.58) U1.2
  vias: v1(28.37,6.83) v1(28.37,6.33) v1(28.88,6.83) v1(28.88,6.33)
CAN1_RXD: length 21.4
  Inner1 w0.127: v1(7.93,34.01) 7.49,34.44 4.5,34.44 3.53,33.48 3.53,25.41 7.17,21.77 7.17,19.1 v1(7.58,18.7)
CAN1_TXD: length 16.8
  Inner1 w0.127: v1(7.83,22.51) 6.74,22.51 3.75,25.5 3.75,33.39 4.37,34.01 v1(7.13,34.01)
CAN1H: length 5
  Top Layer w0.381: X12.2 4.24,19.98 2.98,21.24 v1(2.54,21.24)
  Bottom Layer w0.381: v1(2.54,21.24) 2.34,21.03 R79.2
CAN1L: length 5
  Bottom Layer w0.381: R79.1 2.34,20.17 U9.6 3.08,19.97 4.34,21.23 v1(5.22,21.23)
CAN2_RXD: length 20.9
  Inner4 w0.127: v1(3.65,52.06) 6.54,49.17 6.54,34.83 6.92,34.44 8.32,34.44 8.68,34.81 v1(8.73,34.81)
CAN2_TXD: length 17.5
  Inner4 w0.127: v1(7.93,34.81) 7.48,35.25 7.48,52.06 v1(7.46,52.06)
CAN2H: length 5
  Bottom Layer w0.254: v1(4.97,54.79) 4.97,55.89 6.19,57.11 U8.7 6.19,59.04 R80.2
CAN2L: length 5.1
  Top Layer w0.254: X11.1 6.22,55.72 4.92,57.02 v1(4.92,57.47)
  Bottom Layer w0.254: v1(4.92,57.47) 4.92,58.98 R80.1
CAN3_RXD: length 29.9
  Top Layer w0.127: v1(26.86,38.89) 23.68,38.89 22.54,37.75 20.76,37.75 19.11,39.4 14.92,39.4 v1(14.33,38.81)
  Bottom Layer w0.127: U7.4 32.57,47.91 30.79,46.13 30.79,42.95 28.47,40.63 27.85,40.63 26.86,39.64 v1(26.86,38.89)
CAN3_TXD: length 32.2
  Top Layer w0.127: v1(13.53,38.81) 14.5,39.78 19.37,39.78 21.02,38.13 22.29,38.13 23.68,39.53 v1(27.24,39.53)
  Bottom Layer w0.127: U7.1 36.38,51.21 31.18,46 31.18,42.7 28.89,40.41 28.13,40.41 v1(27.24,39.53)
CAN3H: length 5.2
  Bottom Layer w0.254: v1(33.78,54.7) 33.78,55.21 35.11,56.54 U7.7 35.11,59 R81.2
CAN3L: length 5.1
  Top Layer w0.254: v1(33.84,57.54) 33.84,56.44 35.03,55.25 X10.1
  Bottom Layer w0.254: R81.1 33.84,59.16 v1(33.84,57.54)
CS1_ACCEL: length 20.1
  Inner2 w0.127: v1(11.93,33.21) 11.36,32.64 11.36,28.09 14.92,24.54 19.11,24.54 20.25,25.68 20.25,27.67 v1(21.58,29)
CS1_GYRO: length 12.2
  Top Layer w0.127: U10.5 19.49,30.5 v1(20,29.99)
  Inner2 w0.127: v1(20,29.99) 19.62,30.38 19.62,34.19 19.37,34.44 13.9,34.44 13.53,34.07 v1(13.53,34.01)
DBUS: length 1.5
  Bottom Layer w0.254: R145.1 35.88,6.23 U19.1
DIO: length 13
  Top Layer w0.254: U25.4 13.65,47.97 v1(12.9,47.97)
  Inner1 w0.127: v1(7.13,38.81) 7.13,42.91 12.19,47.97 v1(12.9,47.97)
DIO_C: length 3.7
  Top Layer w0.254: v1(11.25,45.25) 11.88,45.25 12.9,46.27 R135.1 13.03,46.85 U25.6
DIO_I: length 5.4
  Top Layer w0.254: U25.1 13.39,44.73 12.76,44.73 12,43.97 v1(11.25,43.97)
DIO_O: length 8.5
  Top Layer w0.254: v1(15.56,41.42) 15.94,41.81 15.94,45.62 16.95,46.64 16.95,47.65 16.46,48.15 U25.3
DRDY_IST8310: length 39
  Top Layer w0.127: v1(11.93,35.61) 12.35,35.19 12.35,31.49 11.61,30.75 11.61,26.83 v1(13.4,25.05)
  Inner3 w0.127: v1(2.13,3.33) 3.49,3.33 5.4,5.24 5.4,11.46 8.27,14.33 8.27,19.92 v1(13.4,25.05)
EN: length 1.7
  Top Layer w0.381: v1(28.75,56.67) 27.77,55.69 R144.1
ESP_DN: length 19.9
  Top Layer w0.254: 20.75,54.86 20.75,52.61 20.5,52.35 20,52.35 19.75,52.61 19.75,53.59
  Inner1 w0.127: v1(28.75,43.97) 27.74,43.97 25.72,46 24.96,46 20.51,50.45 20.51,54.39 20.75,54.63 v1(20.75,54.89)
ESP_DP: length 19.9
  Top Layer w0.254: 19.25,53.59 19.25,54.65 19.49,54.89 v1(20,54.89) 20.25,54.64 20.25,53.59
  Inner1 w0.127: v1(20,54.89) 20,54.64 20.24,54.4 20.24,49.96 24.47,45.72 25.55,45.72 28.57,42.7 v1(28.75,42.7)
ESP_LED: length 9.6
  Top Layer w0.254: v1(14.28,41.42) 14.91,40.8 15.81,40.8 16.26,41.25 16.26,41.63 16.7,42.06 17.21,42.06 17.97,42.83 17.97,46.67 LED6.2
FB: length 5.1
  Top Layer w0.254: v1(28.72,4.29) 29.97,4.29 R10.2 R8.1 R9.1
  Bottom Layer w0.254: U1.9 28.85,4.42 v1(28.72,4.29)
FB5V: length 4.5
  Top Layer w0.254: C14.1 26.52,13.21 R16.2 27.85,12.84 R15.2 29.4,13.22 U2.1
GPIO0: length 4.3
  Top Layer w0.254: SW7.2 13.35,42.7 v1(10.98,42.7)
I2C2_SCL: length 20
  Inner4 w0.127: v1(11.97,17.42) 13.98,19.43 13.98,35.96 v1(13.53,36.41)
I2C2_SDA: length 22.2
  Inner4 w0.127: v1(10.72,17.42) 11.09,17.05 12.09,17.05 14.77,19.72 14.77,35.97 v1(14.33,36.41)
I2C3_SCL: length 44
  Top Layer w0.254: U11.1 2.02,1.55 1.59,1.55 1.16,1.13 v1(1.16,0.92)
  Inner4 w0.127: v1(1.16,0.92) 6.03,5.78 6.03,8.54 7.68,10.19 7.68,16.13 11.11,19.56 11.11,31.83 9.97,32.97 9.97,37.57 v1(9.53,38.01)
I2C3_SDA: length 44.4
  Top Layer w0.254: v1(0.97,2.9) 1.03,2.83 U11.16
  Inner4 w0.127: v1(10.33,38.01) 9.95,38.38 9.33,38.38 9.08,38.13 9.08,32.28 9.33,32.03 10.6,32.03 10.86,31.78 10.86,19.61 7.47,16.22 7.47,12.31 5.69,10.53 5.69,5.91 2.68,2.9 v1(0.97,2.9)
INT1_ACCEL: length 18
  Inner2 w0.127: v1(20,28.21) 20,25.94 18.86,24.79 15.43,24.79 12.63,27.59 12.63,31.14 12.38,31.4 12.38,33.56 v1(11.93,34.01)
INT1_GYRO: length 19.1
  Inner2 w0.127: v1(21.4,30) 21.15,30 19.49,28.35 19.62,28.22 19.62,26.06 18.6,25.05 16.32,25.05 13.9,27.46 13.9,30.51 13.14,31.27 13.14,33.59 v1(12.73,34.01)
KEY: length 5.7
  Top Layer w0.254: SW8.2 20.85,43.04 19.23,41.42 v1(16.82,41.42)
NG2: length 3.5
  Top Layer w0.254: v1(21.12,9.36) 21.12,10.69 v1(21.18,10.75)
  Inner1 w0.254: v1(21.18,10.75) 21.18,11.16 v1(20.03,12.31)
NRST: length 47.5
  Top Layer w0.127: v1(11.25,50.33) 11.25,50.32 v1(6.16,50.32)
  Top Layer w0.508: v1(4.13,27.11) 4.13,28.42 C104.2 3.65,28.44 2.97,29.13 KEY2.1
  Inner1 w0.127: v1(10.33,31.61) 11.76,30.17 11.76,25.19 10.86,24.28 5.27,24.28 4.13,25.43 v1(4.13,27.11)
  Inner2 w0.127: v1(10.33,31.61) 9.9,32.03 7.43,32.03 6.03,33.43 6.03,50.19 v1(6.16,50.32)
OSC_IN: length 6.4
  Top Layer w0.254: C49.2 7.14,27.37 X13.3 7.94,28.77 7.94,30.25 8.73,31.05 U6.C1
OSC_OUT: length 6.4
  Top Layer w0.254: C48.1 7.94,26.84 7.94,28.28 9.04,29.39 X13.1 9.53,29.91 9.53,31.61
PA0: length 30.5
  Inner1 w0.127: v1(11.93,32.41) 12.33,32 12.33,31.19 12.63,30.89 14.59,30.89 15.44,31.74 15.44,33.9 16.56,35.02 23.47,35.02 24.39,34.09 24.39,23.68 H5.1
PA1: length 27
  Inner1 w0.127: v1(12.73,32.41) 13.14,31.99 13.14,31.5 13.5,31.14 14.54,31.14 15.22,31.83 15.22,33.99 16.47,35.23 23.56,35.23 24.61,34.18 24.61,26.06 H6.1
PA2: length 22.7
  Inner1 w0.127: v1(13.53,32.41) 13.98,31.96 14.59,31.96 15.01,32.38 15.01,34.08 16.38,35.45 23.64,35.45 24.83,34.27 24.83,28.45 H7.1
PA3: length 19.1
  Inner1 w0.127: v1(14.33,32.41) 14.79,32.87 14.79,34.17 16.29,35.66 23.73,35.66 25.22,34.18 25.22,30.66 H8.1
PA6: length 23.5
  Inner3 w0.127: v1(13.53,33.21) 13.12,32.79 7.55,32.79 7.16,32.4 7.16,32.03 6.68,31.55 6,31.55 5.14,32.41 5.14,34.19 2.22,37.11 2.22,43.08 v1(0.82,44.48)
PA7: length 29.3
  Top Layer w0.127: R148.1 27.05,49.75 26.48,49.18 26.48,47.4 v1(26.6,47.27) ; v1(14.33,33.21) 16.2,35.08 20.63,35.08 23.94,38.38 27.24,38.38 27.62,38.76 27.62,40.41 26.86,41.18 26.86,45.37 v1(26.6,45.62)
  Bottom Layer w0.127: v1(26.6,45.62) v1(26.6,47.27)
PA10: length 10.3
  Inner1 w0.127: v1(9.53,38.81) 9.1,38.38 8.32,38.38 7.55,37.62 6.66,37.62 6.22,37.18 4.84,37.18 v1(1.99,34.32)
  Bottom Layer w0.254: v1(1.99,34.32) 2.05,34.38 R183.1
PB1: length 13.6
  Inner1 w0.127: v1(14.33,34.01) 16.2,35.88 25.19,35.88 H9.1
PD14: length 15.5
  Inner4 w0.127: 15.94,23.9 15.81,24.03 15.81,35.59 14.54,36.86 13.08,36.86 v1(12.73,37.21)
  vias: v1(15.83,23.91)
PD15: length 20.9
  Inner1 w0.127: v1(11.93,37.21) 12.28,36.85 14.54,36.85 15.3,36.1 27.24,36.1 28,35.33 28,33.27 H10.1
PE9: length 32
  Inner2 w0.127: v1(1.99,32.55) 2.47,32.06 2.47,25.43 3.62,24.28 10.98,24.28 12,25.3 12,27.15 11.15,28.01 11.15,33.17 10.73,33.59 10.73,34.32 10.86,34.44 13.01,34.44 13.38,34.81 v1(14.33,34.81)
  Bottom Layer w0.254: v1(1.99,32.55) 2.05,32.6 R184.1
PE11: length 15.4
  Inner1 w0.127: v1(1.99,30.77) 2.6,31.38 2.6,33.81 4.38,35.59 5.65,35.59 6.03,35.21 12.33,35.21 v1(12.73,35.61)
  Bottom Layer w0.254: R185.1 2.05,30.83 v1(1.99,30.77)
PG1: length 1.5
  Bottom Layer w0.254: R195.2 22.77,9.68 22.42,9.33
PG5V: length 4.1
  Bottom Layer w0.254: U1.11 v1(27.95,4.29) 28.25,3.99 28.25,3.08 27.77,2.59 v1(27.77,1.17)
RSTN_IST8310: length 38.6
  Top Layer w0.127: v1(11.93,36.41) 11.54,36.02 11.54,31.06 11.39,30.92 11.39,26.03 v1(12.38,25.05)
  Inner3 w0.127: v1(1.87,3.83) 3.69,3.83 5.18,5.32 5.18,11.55 8.05,14.42 8.05,20.01 12.38,24.34 v1(12.38,25.05)
SPI1_MISO: length 20.5
  Top Layer w0.127: v1(21.66,31) 22.03,30.63 22.03,28.86 21.65,28.48 21.23,28.48 U10.15
  Inner3 w0.127: v1(7.13,35.61) 7.53,35.21 18.48,35.21 19.75,33.94 19.75,32.65 21.39,31 v1(21.66,31)
SPI1_MOSI: length 14.7
  Inner3 w0.127: v1(21.4,31.5) 20.25,32.65 20.25,34.06 18.35,35.97 9.89,35.97 v1(9.53,35.61)
SPI1_SCK: length 16.8
  Inner2 w0.127: v1(20,31.76) 20,34.57 19.37,35.21 7.68,35.21 7.55,35.33 7.55,35.98 v1(7.13,36.41)
SPI4_CS: length 28.2
  Top Layer w0.127: 7.13,32.41 6.63,31.91 v1(6.54,31.91)
  Inner3 w0.127: v1(24.24,37.02) 21.14,40.12 6.96,40.12 6,39.17 6,32.44 v1(6.54,31.91)
SPI4_MISO: length 30.6
  Inner3 w0.127: v1(9.53,33.21) 7.9,33.21 7.5,33.61 6.9,33.61 6.43,34.07 6.43,38.99 7.14,39.69 19.32,39.69 22.66,36.35 26.07,36.35 v1(26.74,37.02)
SPI4_MOSI: length 32.1
  Inner3 w0.127: v1(10.33,33.21) 9.98,33.56 9.46,33.56 9.18,33.84 9.18,34.09 8.82,34.44 6.92,34.44 6.65,34.72 6.65,38.87 7.25,39.47 18.54,39.47 22.04,35.97 26.94,35.97 v1(27.99,37.02)
SPI4_SCK: length 27.6
  Inner3 w0.127: v1(25.49,37.02) 24.99,37.02 24.57,36.6 23.56,36.6 20.25,39.91 7.05,39.91 6.22,39.08 6.22,33.75 6.76,33.21 v1(7.13,33.21)
SWCLK: length 10.2
  Inner1 w0.127: v1(11.25,46.52) 11.24,46.52 7.55,42.83 7.55,38.43 v1(7.13,38.01)
UART1_RX: length 21.1
  Inner2 w0.127: v1(7.13,34.81) 6.28,35.65 6.28,48.92 10.22,52.86 v1(11.24,52.86)
UART1_TX: length 15
  Inner2 w0.127: v1(11.24,51.59) 8.32,48.67 8.32,38.42 v1(8.73,38.01)
UART2_RX: length 26.8
  Inner2 w0.127: v1(34.74,37.52) 23.97,37.52 22.41,35.97 9.09,35.97 v1(8.73,35.61)
UART2_TX: length 28.1
  Inner2 w0.127: v1(34.74,38.77) 33.71,37.74 23.88,37.74 22.9,36.76 9.08,36.76 v1(7.93,35.61)
UART3_RX: length 50
  Top Layer w0.127: v1(7.93,37.21) 8.34,37.62 10.6,37.62 10.75,37.47 10.75,31.37 11.18,30.95 11.18,25.75 v1(10.47,25.05)
  Inner3 w0.127: v1(16.57,19.84) 16.57,19.2 17.33,18.44 22.04,18.44 33.3,7.19 v1(33.3,5.09)
  Bottom Layer w0.127: v1(16.57,19.84) 15.68,19.84 v1(10.47,25.05)
  Bottom Layer w0.254: R146.1 33.88,4.56 U19.3
UART4_RX: length 34.8
  Inner1 w0.127: v1(34.73,28.38) 34.1,29.02 34.1,34.67 31.02,37.75 18.6,37.75 16.19,40.16 10.08,40.16 v1(8.73,38.81)
UART4_TX: length 35.2
  Inner1 w0.127: v1(34.73,29.63) 35.24,30.14 35.24,33.84 30.95,38.13 18.86,38.13 16.44,40.54 9.66,40.54 v1(7.93,38.81)
UART5_RX: length 43.3
  Inner1 w0.127: v1(7.93,36.41) 9.83,36.41 11.17,37.75 17.21,37.75 18.5,36.45 31.71,36.45 33.66,34.5 33.66,20.31 v1(34.74,19.23)
UART5_TX: length 41.3
  Inner1 w0.127: v1(8.73,37.21) 9.14,37.62 10.6,37.62 10.94,37.96 17.62,37.96 18.92,36.67 31.8,36.67 33.88,34.58 33.88,21.35 v1(34.74,20.48)
UART6_RX: length 29.6
  Inner4 w0.127: v1(10.33,38.81) 10.73,38.41 10.73,32.79 11.49,32.03 11.49,19.64 9.82,17.97 9.82,13.43 v1(11.97,11.29)
UART6_TX: length 32.7
  Inner4 w0.127: v1(11.13,38.81) 11.13,37.86 11.49,37.49 11.49,32.92 11.62,32.79 12.15,32.79 12.38,32.57 12.38,31.39 11.75,30.76 11.75,19.58 10.04,17.88 10.04,13.72 12.38,11.38 12.38,10.82 12.25,10.7 11.24,10.7 10.72,11.21 v1(10.72,11.29)
UART7_RX: length 32.9
  Inner4 w0.127: v1(12.73,34.81) 13.14,34.39 13.14,29.49 12.76,29.11 12.76,20.22 10.25,17.71 10.25,13.81 12.59,11.47 12.59,7.32 v1(10.46,5.18)
UART7_TX: length 39.7
  Top Layer w0.127: v1(4.76,7.39) 4.76,6.5 7.2,4.06 8.92,4.06 9.21,4.35 X15.2
  Inner3 w0.127: v1(3.87,34.44) 3.87,30.89 4.76,30 v1(4.76,7.39)
  Bottom Layer w0.127: v1(3.87,34.44) 3.87,34.95 5.27,36.35 5.27,36.86 5.4,36.98 6.91,36.98 v1(7.13,37.21)
UART8_RX: length 21.8
  Inner1 w0.127: v1(21.49,19.41) 21.49,21.09 18.04,24.54 14.92,24.54 12.85,26.61 12.85,30.17 11.11,31.91 11.11,33.17 10.63,33.65 9.88,33.65 v1(9.53,34.01)
UART8_TX: length 21.7
  Inner1 w0.127: v1(20.24,19.41) 20.24,22.03 17.99,24.28 14.87,24.28 12.51,26.65 12.51,30.2 9.91,32.79 9.08,32.79 8.7,33.17 8.73,33.21 v1(8.73,34.01)
UKEY: length 10.5
  Top Layer w0.508: KEY1.1 2.9,40.11 3.49,39.53 4.12,39.53 ; R120.1 4.12,38.3 4.12,39.53 ; 4.12,39.53 C105.2
  Inner1 w0.127: v1(9.53,37.21) 9.53,36.98 9.34,36.79 5.2,36.79 v1(4.89,36.48)
  Bottom Layer w0.127: v1(4.89,36.48) 4.89,37.49 v1(4.12,38.25)
$1N2698: length 1.5
  Bottom Layer w0.254: C7.2 31.02,4.93 U1.7
$1N2865: length 1.3
  Top Layer w0.254: R8.2 31.8,1.3 C8.1
$1N3434: length 1.2
  Bottom Layer w0.254: U1.8 C12.2
$1N3813: length 2.1
  Top Layer w0.381: U2.6 30.66,17.19 30.55,17.3
$1N3995: length 2.1
  Top Layer w0.254: U2.2 30.16,13.13 29.64,12.6 29.4,12.6 28.98,12.18 R13.2
$1N4166: length 2.5
  Top Layer w0.254: v1(27.68,3.51) R12.2
  Bottom Layer w0.254: v1(27.68,3.51) 27.5,3.69 U1.12
$1N5989: length 1.5
  Top Layer w0.254: LED2.1 25.09,16.23 R18.2
$1N12755: length 1.6
  Top Layer w0.254: R137.2 21.25,53.59
$1N12756: length 1.6
  Top Layer w0.254: R138.1 18.22,53.56 18.25,53.59
$1N13588: length 0.9
  Bottom Layer w0.711: R141.2 16.82,22.71 v1(16.82,23.53)
  vias: v1(16.82,23.91)
$1N13591: length 10
  Bottom Layer w0.381: v1(18.89,22.89) 18.89,25.24 19.75,26.1 19.75,27.21 R177.1 R178.1 R179.1 R180.1
$1N13808: length 2.2
  Top Layer w0.711: Q5.3 28.6,48.29 CN5.2
$1N13809: length 2.8
  Top Layer w0.635: Q5.1 27.91,50.44 R148.2 R142.2
$1N14042: length 2.2
  Bottom Layer w0.254: H4.3 37.83,7.19 R145.2
$1N14320: length 8.8
  Top Layer w0.508: D8.2 8.87,45.18 v1(9.96,44.1)
  Bottom Layer w0.508: v1(5.23,43.21) 6.12,44.1 v1(9.96,44.1)
$1N14321: length 2.9
  Top Layer w0.508: Q6.1 2.61,44.48 R147.2 1.72,43.69 1.16,43.13
$1N18676: length 1.5
  Top Layer w0.254: C85.2 3.65,6.24 U11.10
$1N19697: length 4.7
  Top Layer w0.127: v1(15.56,37.33) 15.27,37.62 11.54,37.62 v1(11.13,37.21)
$1N19698: length 5
  Top Layer w0.127: v1(5.65,36.44) 5.99,36.78 9.95,36.78 v1(10.33,36.41)
$1N21869:
  vias: v1(1.14,35.2)
$1N21874:
  vias: v1(1.12,33.43)
$1N21879:
  vias: v1(1.12,31.66)
$1N21958: length 3.3
  Top Layer w0.254: R187.1 12.67,52.15 12.67,54.04 12.41,54.29 LED7.2
$1N21960: length 1.8
  Top Layer w0.254: R186.1 12.1,53.14 11.24,54 LED7.4
$1N55737: length 1.4
  Bottom Layer w0.559: C128.2 16.43,1.59 R190.1
$1N56264: length 2.9
  Bottom Layer w0.508: 18.88,3.11 18.81,3.03
  Bottom Layer w0.559: R193.1 18.55,2.78 18.81,3.03 D11.1
$1N56426: length 2.9
  Bottom Layer w0.559: Q7.1 20.72,2.61 20.72,1.56 R193.2
$1N56574: length 11.2
  Top Layer w0.559: v1(22.32,3.97) 23.63,5.27 v1(23.63,9.93)
  Bottom Layer w0.508: 23.14,1.56 R194.2
  Bottom Layer w0.559: v1(23.63,9.93) R195.1 ; 23.14,1.56 C129.1 22.32,2.07 v1(22.32,3.97)
$1N56906: length 1.3
  Bottom Layer w0.559: C130.2 R196.1
$1N67088: length 1.6
  Top Layer w0.254: LED1.1 29.71,1.52 R197.2

## Copper pours and planes (outline as drawn; the poured copper is in the pictures)
+3.3V on Top Layer: 29.14,16.16 27.29,16.16 27.13,16 25.97,16 25.97,17.31 26.87,17.31 27.87,18.32 29.27,18.32 29.27,16.29
+24V on Bottom Layer: 29.14,5.36 29.14,6.86 28.23,7.77 26.07,7.77 24.42,6.12 23.3,6.12 22.79,5.62 21.52,5.62 21.52,8.53 22.41,8.53 23.46,9.57 30.41,9.57 30.84,9.15 30.84,5.53 30.67,5.36
+24V_BAT on Top Layer: 21.27,8.79 23.05,8.79 23.05,10.31 24.19,11.46 24.19,14.38 15.3,14.38 14.79,13.87 14.79,6.76 14.28,6.25 14.28,4.98 16.82,4.98 16.82,8.54 19.49,11.2 21.27,11.2
GND on Top Layer: -1.84,61.88 41.34,61.88 41.34,-1.12 -1.84,-1.12
GND on Bottom Layer: -2.61,63.53 42.1,63.53 42.1,-2.26 -2.61,-2.26
GND on Inner1: -3.5,63.53 42.61,63.53 42.61,-3.02 -3.5,-3.02
GND on Inner2: -5.65,66.19 45.53,66.19 45.53,-5.31 -5.65,-5.31
GND on Inner3: -9.59,69.37 48.7,69.37 48.7,-7.08 -9.59,-7.08
GND on Inner4: -13.02,71.66 51.5,71.66 51.5,-9.88 -13.02,-9.88
GND_BAT on Bottom Layer: 15.81,14.76 15.81,11.57 16.82,10.56 16.82,5.46 15.93,4.56 15.93,3.79 16.18,3.54 17.93,3.54 18.38,4 18.38,4.49 18.62,4.49 19.62,5.49 21.4,5.49 21.4,8.41 21.27,8.54 19.24,8.54 19.24,14.76

Small or netless copper shapes (teardrops, artwork), in the pictures only: 226 on Top Layer, 97 on Bottom Layer, 44 on Inner1, 21 on Inner2, 22 on Inner3, 18 on Inner4

## Text on the board
Bottom Silkscreen Layer: Designde by Lyra | Development Board F-I | qs 31231116005 | 24V MAX
Top Silkscreen Layer: PA6 | 25MHZ | 3 G SDA2 SCL2 | STM32H723VGH6 | + G T R 6 | RX TX | G T R 7 | PD14 | CS SCK SO SI G 3 | + G T R 8 | PA17 | POWER3.3 | USER | RST | POWER5 | DBUS | B1  D15  A3  A2  A1  A0 | + G T R 4 | + G T R 5 | + G T R 2 | CAN2 / H  L | CAN3 / H  L | CAN1 / H  L | A | B
